# EAGLE schematic NotNightVision_r002 (EAGLE 7.5.0)
AUTHOR: Joshua Alexander; REVISION: 001

## Sheet 1 of 2
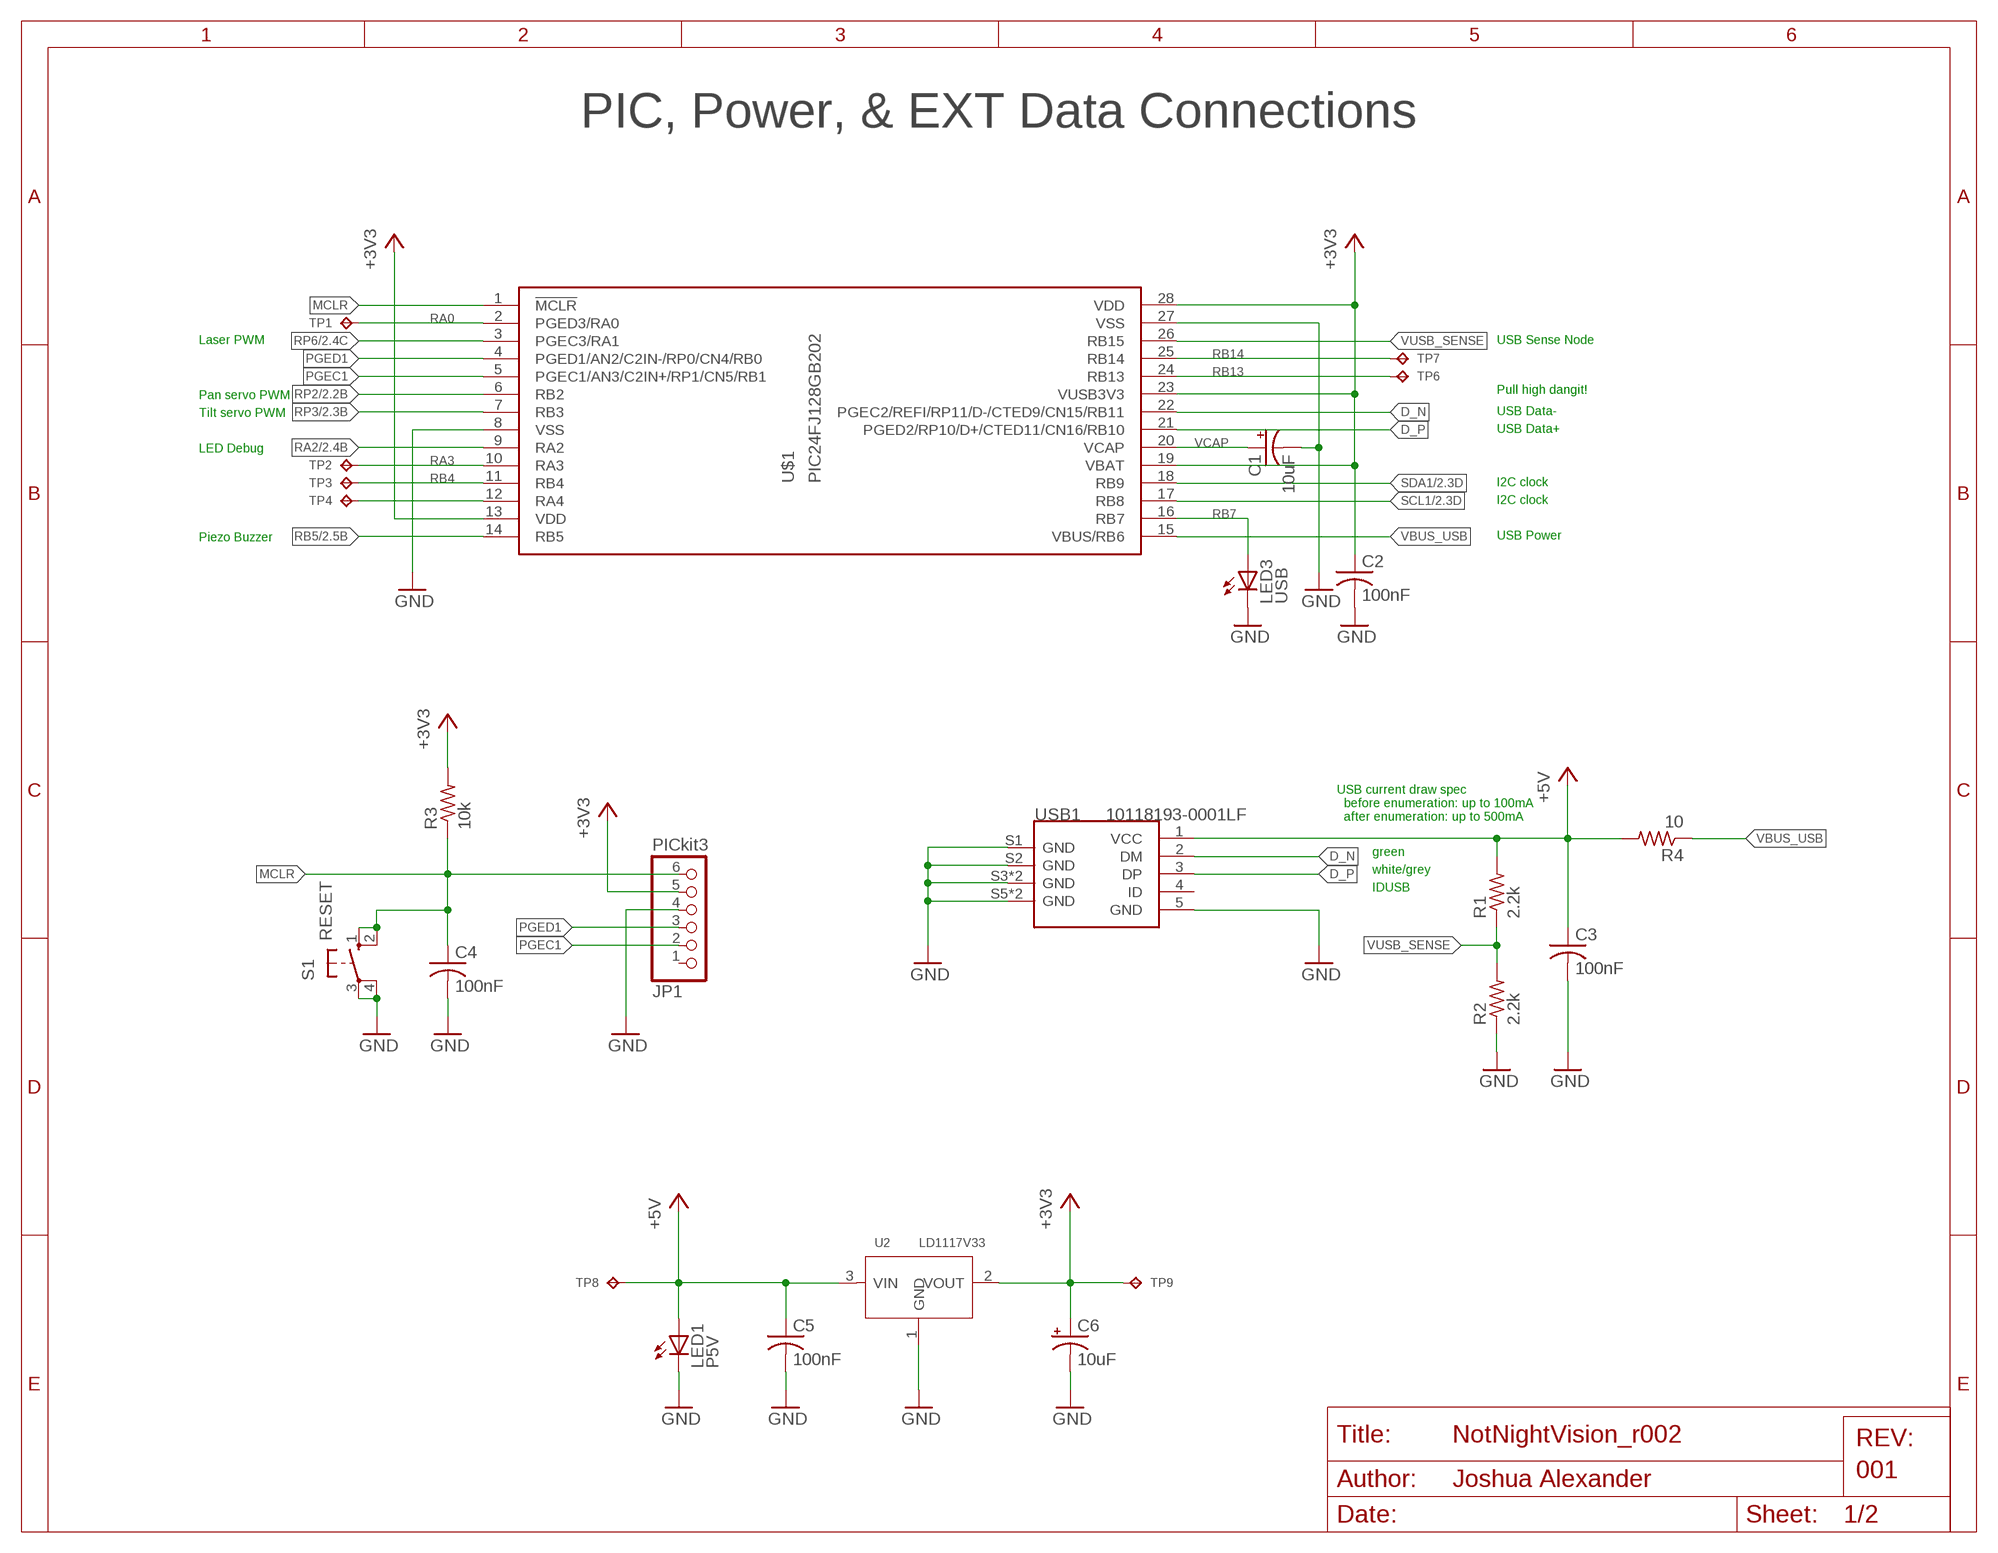
[diagram p0: schematic, sheet 1]

### Parts
C1  10uF  CPOL-USE2.5-7  [E2,5-7]
C2  100nF  C-US050-030X075  [C050-030X075]
C3  100nF  C-US050-030X075  [C050-030X075]
C4  100nF  C-US050-030X075  [C050-030X075]
C5  100nF  C-US050-030X075  [C050-030X075]
C6  10uF  CPOL-USE2.5-7  [E2,5-7]
JP1  PICkit3  PINHD-1X6/90  [1X06/90]
LED1  P5V  LED5MM  [LED5MM]
LED3  USB  LED3MM  [LED3MM]
R1  2.2k  R-US_0207/7  [0207/7]
R2  2.2k  R-US_0207/7  [0207/7]
R3  10k  R-US_0207/7  [0207/7]
R4  10  R-US_0207/7  [0207/7]
S1  RESET  10-XX  [B3F-10XX]
TP1  TP10  [10MIL_ROUND]
TP2  TP10  [10MIL_ROUND]
TP3  TP10  [10MIL_ROUND]
TP4  TP10  [10MIL_ROUND]
TP6  TP10  [10MIL_ROUND]
TP7  TP10  [10MIL_ROUND]
TP8  TP10  [10MIL_ROUND]
TP9  TP10  [10MIL_ROUND]
U2  LD1117V33  LD1117V33TO220V  [TO-220V]
U$1  PIC24FJ128GB202  [DIL28-3]
USB1  10118193-0001LF  MICRO-USB-SMD-B-(10118193-0001LF)  [MICRO-USB5+6P-SMD-0.65-B]

### Nets
+3V3 [power]: C2.1 C6.+ JP1.5 R3.2 TP9.TP U2.2(VOUT) U$1.13(VDD) U$1.19(VBAT) U$1.23(VUSB3V3) U$1.28(VDD) ; also sheet 2
+5V [power]: C3.1 C5.1 LED1.A R1.2 R4.2 TP8.TP U2.3(VIN) USB1.1(VCC) ; also sheet 2
D_N [usb]: U$1.22(PGEC2/REFI/RP11/D-/CTED9/CN15/RB11) USB1.2(DM)
D_P [usb]: U$1.21(PGED2/RP10/D+/CTED11/CN16/RB10) USB1.3(DP)
GND [power]: C1.- C2.2 C3.2 C4.2 C5.2 C6.- JP1.4 LED1.K(C) LED3.K(C) R2.1 S1.3(P) S1.4(P1) U2.1(GND) U$1.8(VSS) U$1.27(VSS) USB1.5(GND) USB1.S1(GND) USB1.S2(GND) USB1.S3(GND) USB1.S4(GND) USB1.S5(GND) USB1.S6(GND) ; also sheet 2
MCLR: C4.1 JP1.6 R3.1 S1.1(S) S1.2(S1) U$1.1(!MCLR)
PGEC1: JP1.2 U$1.5(PGEC1/AN3/C2IN+/RP1/CN5/RB1)
PGED1: JP1.3 U$1.4(PGED1/AN2/C2IN-/RP0/CN4/RB0)
RA0: TP1.TP U$1.2(PGED3/RA0)
RA2: U$1.9(RA2) ; also sheet 2
RA3: TP2.TP U$1.10(RA3)
RA4: TP4.TP U$1.12(RA4)
RB4: TP3.TP U$1.11(RB4)
RB5: U$1.14(RB5) ; also sheet 2
RB7: LED3.A U$1.16(RB7)
RB13: TP6.TP U$1.24(RB13)
RB14: TP7.TP U$1.25(RB14)
RP2: U$1.6(RB2) ; also sheet 2
RP3: U$1.7(RB3) ; also sheet 2
RP6: U$1.3(PGEC3/RA1) ; also sheet 2
SCL1: U$1.17(RB8) ; also sheet 2
SDA1: U$1.18(RB9) ; also sheet 2
VBUS_USB: R4.1 U$1.15(VBUS/RB6)
VCAP: C1.+ U$1.20(VCAP)
VUSB_SENSE: R1.1 R2.2 U$1.26(RB15)
Unconnected: JP1.1 USB1.4(ID)

### Notes on the sheet
- Laser PWM | USB Sense Node
- Pull high dangit!
- Pan servo PWM
- Tilt servo PWM | USB Data-
- USB Data+
- LED Debug
- I2C clock
- I2C clock
- Piezo Buzzer | USB Power
- USB current draw spec
    before enumeration: up to 100mA
    after enumeration: up to 500mA
- green
- white/grey
- IDUSB

## Sheet 2 of 2
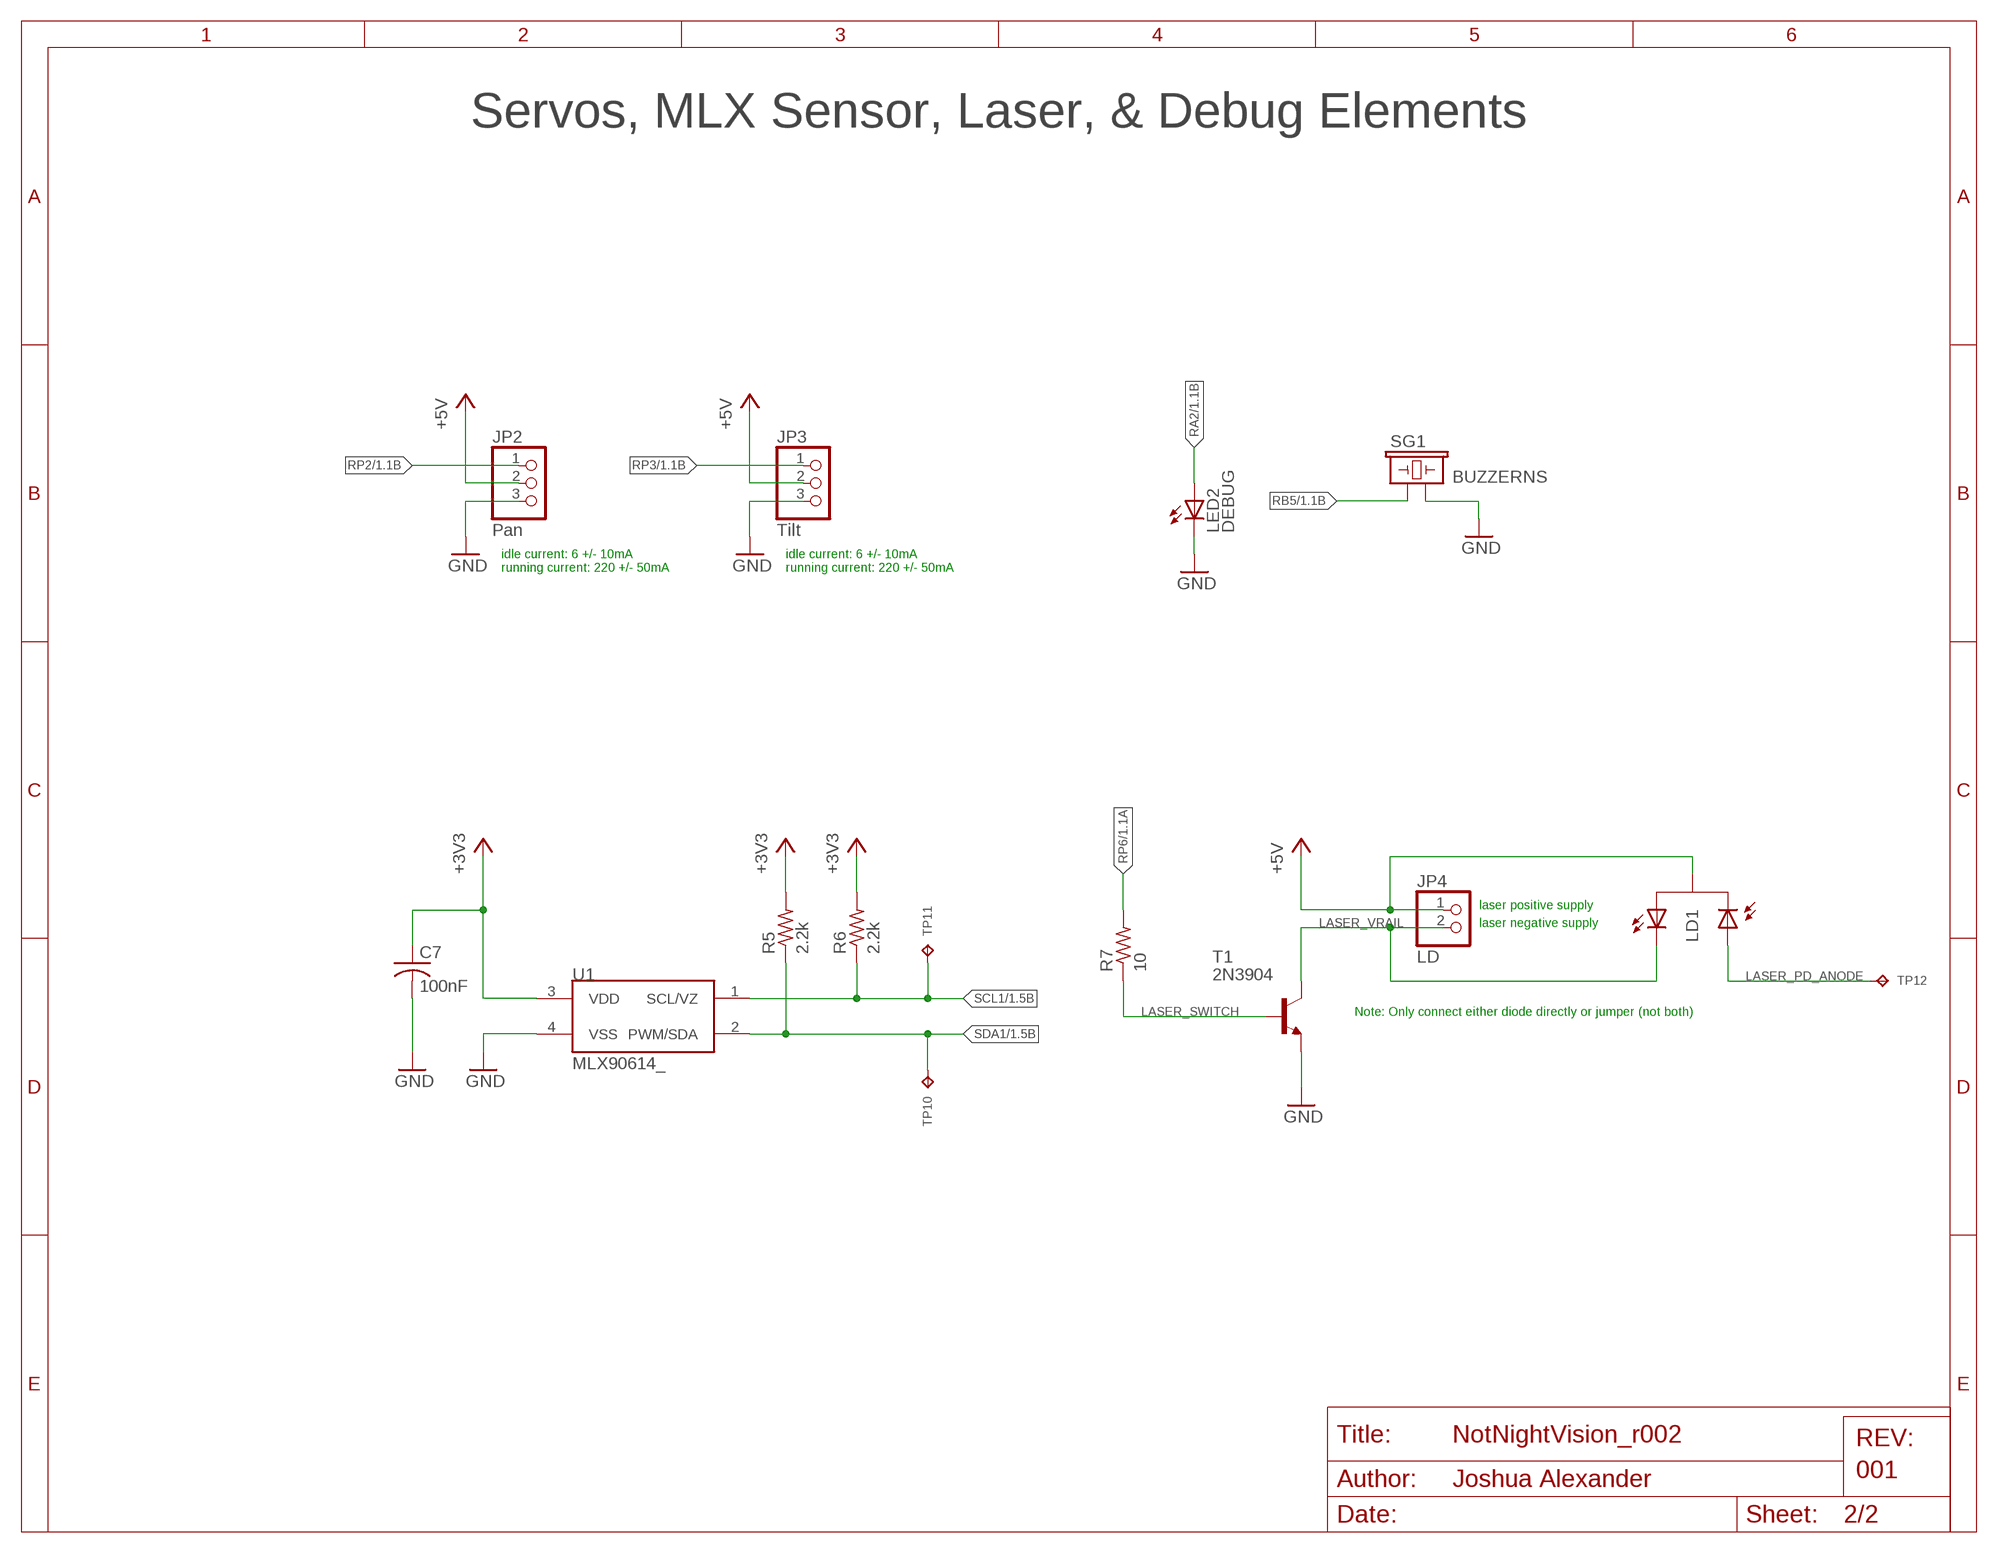
[diagram p1: schematic, sheet 2]

### Parts
C7  100nF  C-US050-030X075  [C050-030X075]
JP2  Pan  PINHD-1X3  [1X03]
JP3  Tilt  PINHD-1X3  [1X03]
JP4  LD  PINHD-1X2  [1X02]
LD1  LASER_DIODE  [TO-18]
LED2  DEBUG  LED3MM  [LED3MM]
R5  2.2k  R-US_0207/7  [0207/7]
R6  2.2k  R-US_0207/7  [0207/7]
R7  10  R-US_0207/7  [0207/7]
SG1  BUZZERNS  [BUZZER-12MM-NS]
T1  2N3904  [TO92]
TP10  TP10  [10MIL_ROUND]
TP11  TP10  [10MIL_ROUND]
TP12  TP10  [10MIL_ROUND]
U1  MLX90614_  [TO-39]

### Nets
+3V3 [power]: C7.1 R5.2 R6.2 U1.3(VDD) ; also sheet 1
+5V [power]: JP2.2 JP3.2 JP4.1 LD1.2(V) ; also sheet 1
GND [power]: C7.2 JP2.3 JP3.3 LED2.K(C) SG1.- T1.3(E) U1.4(VSS) ; also sheet 1
LASER_PD_ANODE: LD1.3(D+) TP12.TP
LASER_SWITCH: R7.1 T1.2(B)
LASER_VRAIL: JP4.2 LD1.1(D-) T1.1(C)
RA2: LED2.A ; also sheet 1
RB5: SG1.+ ; also sheet 1
RP2: JP2.1 ; also sheet 1
RP3: JP3.1 ; also sheet 1
RP6: R7.2 ; also sheet 1
SCL1: R6.1 TP11.TP U1.1(SCL/VZ) ; also sheet 1
SDA1: R5.1 TP10.TP U1.2(PWM/SDA) ; also sheet 1

### Notes on the sheet
- idle current: 6 +/- 10mA
  running current: 220 +/- 50mA
- idle current: 6 +/- 10mA
  running current: 220 +/- 50mA
- laser positive supply
- laser negative supply
- Note: Only connect either diode directly or jumper (not both)

## Library data of the parts
C1 C6 = rcl:CPOL-US: POLARIZED CAPACITOR, American symbol; OC_NEWARK: unknown
C2-C5 C7 = rcl:C-US: CAPACITOR, American symbol; OC_NEWARK: unknown
JP1 = pinhead:PINHD-1X6: PIN HEADER
JP2 JP3 = pinhead:PINHD-1X3: PIN HEADER
JP4 = pinhead:PINHD-1X2: PIN HEADER
LD1 = custom:LASER_DIODE
LED1-LED3 = led:LED: LED OSRAM: - CHIPLED LG R971, LG N971, LY N971, LG Q971, LY Q971, LO R971, LY R971 LH N974, LH R974 LS Q976, LO Q976, LY Q976 LO Q996 - Hyper CHIPLED LW Q18S LB Q993, LB Q99A, LB R99A - SideLED LS A670, LO A670, LY A670, LG A670, LP A670 LB A673, LV A673, LT A673, LW A673 LH A674 LY A675 LS A676, LA A676, LO A676, LY A676, LW A676 LS A679, LY A679, LG A679 - Hyper Micro SIDELED® LS Y876, LA Y876, LO Y876, LY Y876 LT Y87S - SmartLED LW L88C, LW L88S LB L89C, LB L89S, LG L890 LS L89K, LO L89K, LY L89K LS L896, LA L896, LO L896, LY L896 - TOPLED LS T670, LO T670, LY T670, LG T670, LP T670 LSG T670, LSP T670, LSY T670, LOP T670, LYG T670 LG T671, LOG T671, LSG T671 LB T673, LV T673, LT T673, LW T673 LH T674 LS T676, LA T676, LO T676, LY T676, LB T676, LH T676, LSB T676, LW T676 LB T67C, LV T67C, LT T67C, LS T67K, LO T67K, LY T67K, LW E67C LS E67B, LA E67B, LO E67B, LY E67B, LB E67C, LV E67C, LT E67C LW T67C LS T679, LY T679, LG T679 LS T770, LO T770, LY T770, LG T770, LP T770 LB T773, LV T773, LT T773, LW T773 LH T774 LS E675, LA E675, LY E675, LS T675 LS T776, LA T776, LO T776, LY T776, LB T776 LHGB T686 LT T68C, LB T68C - Hyper Mini TOPLED® LB M676 - Mini TOPLED Santana® LG M470 LS M47K, LO M47K, LY M47K Source: http://www.osram.convergy.de LUXEON: - LUMILED® LXK2-PW12-R00, LXK2-PW12-S00, LXK2-PW14-U00, LXK2-PW14-V00 LXK2-PM12-R00, LXK2-PM12-S00, LXK2-PM14-U00 LXK2-PE12-Q00, LXK2-PE12-R00, LXK2-PE12-S00, LXK2-PE14-T00, LXK2-PE14-U00 LXK2-PB12-K00, LXK2-PB12-L00, LXK2-PB12-M00, LXK2-PB14-N00, LXK2-PB14-P00, LXK2-PB14-Q00 LXK2-PR12-L00, LXK2-PR12-M00, LXK2-PR14-Q00, LXK2-PR14-R00 LXK2-PD12-Q00, LXK2-PD12-R00, LXK2-PD12-S00 LXK2-PH12-R00, LXK2-PH12-S00 LXK2-PL12-P00, LXK2-PL12-Q00, LXK2-PL12-R00 Source: www.luxeon.com KINGBRIGHT: KA-3528ASYC Source: www.kingbright.com
R1-R7 = rcl:R-US_: RESISTOR, American symbol; OC_NEWARK: unknown
S1 = switch-omron:10-XX: OMRON SWITCH; MPN: B3F-1000; OC_FARNELL: 176432; OC_NEWARK: 36M3542
SG1 = SparkFun-Electromechanical:BUZZER: Buzzer 12mm Spark Fun Electronics SKU : Comp-Buzzer
T1 = transistor:2N3904: NPN TRANSISTOR
TP1-TP4 TP6-TP12 = custom:TP: Test pad
U1 = SparkFun-Sensors:MLX90614: Non-contact PIR I2C interface temperature sensor; MPN: 1747; OC_NEWARK: 28Y4967
U2 = custom:LD1117V33: 310030025
U$1 = custom:PIC24FJ128GB202; OC_NEWARK: unknown
USB1 = Seeed-OPL-Connector:MICRO-USB-SMD-B-(10118193-0001LF): 320010003; MPN: 10118193-0001LF; OC_NEWARK: 67T2259

## Net classes
0 default: width 0.203 mm, drill 0.381 mm, clearance 0.203 mm
1 power: width 0.381 mm, drill 0.381 mm, clearance 0.203 mm
2 usb: width 0.191 mm, drill 0.381 mm, clearance 0.203 mm